# EAGLE design Z80-Clock-And-Reset-1-2 (EAGLE 9.6.2)
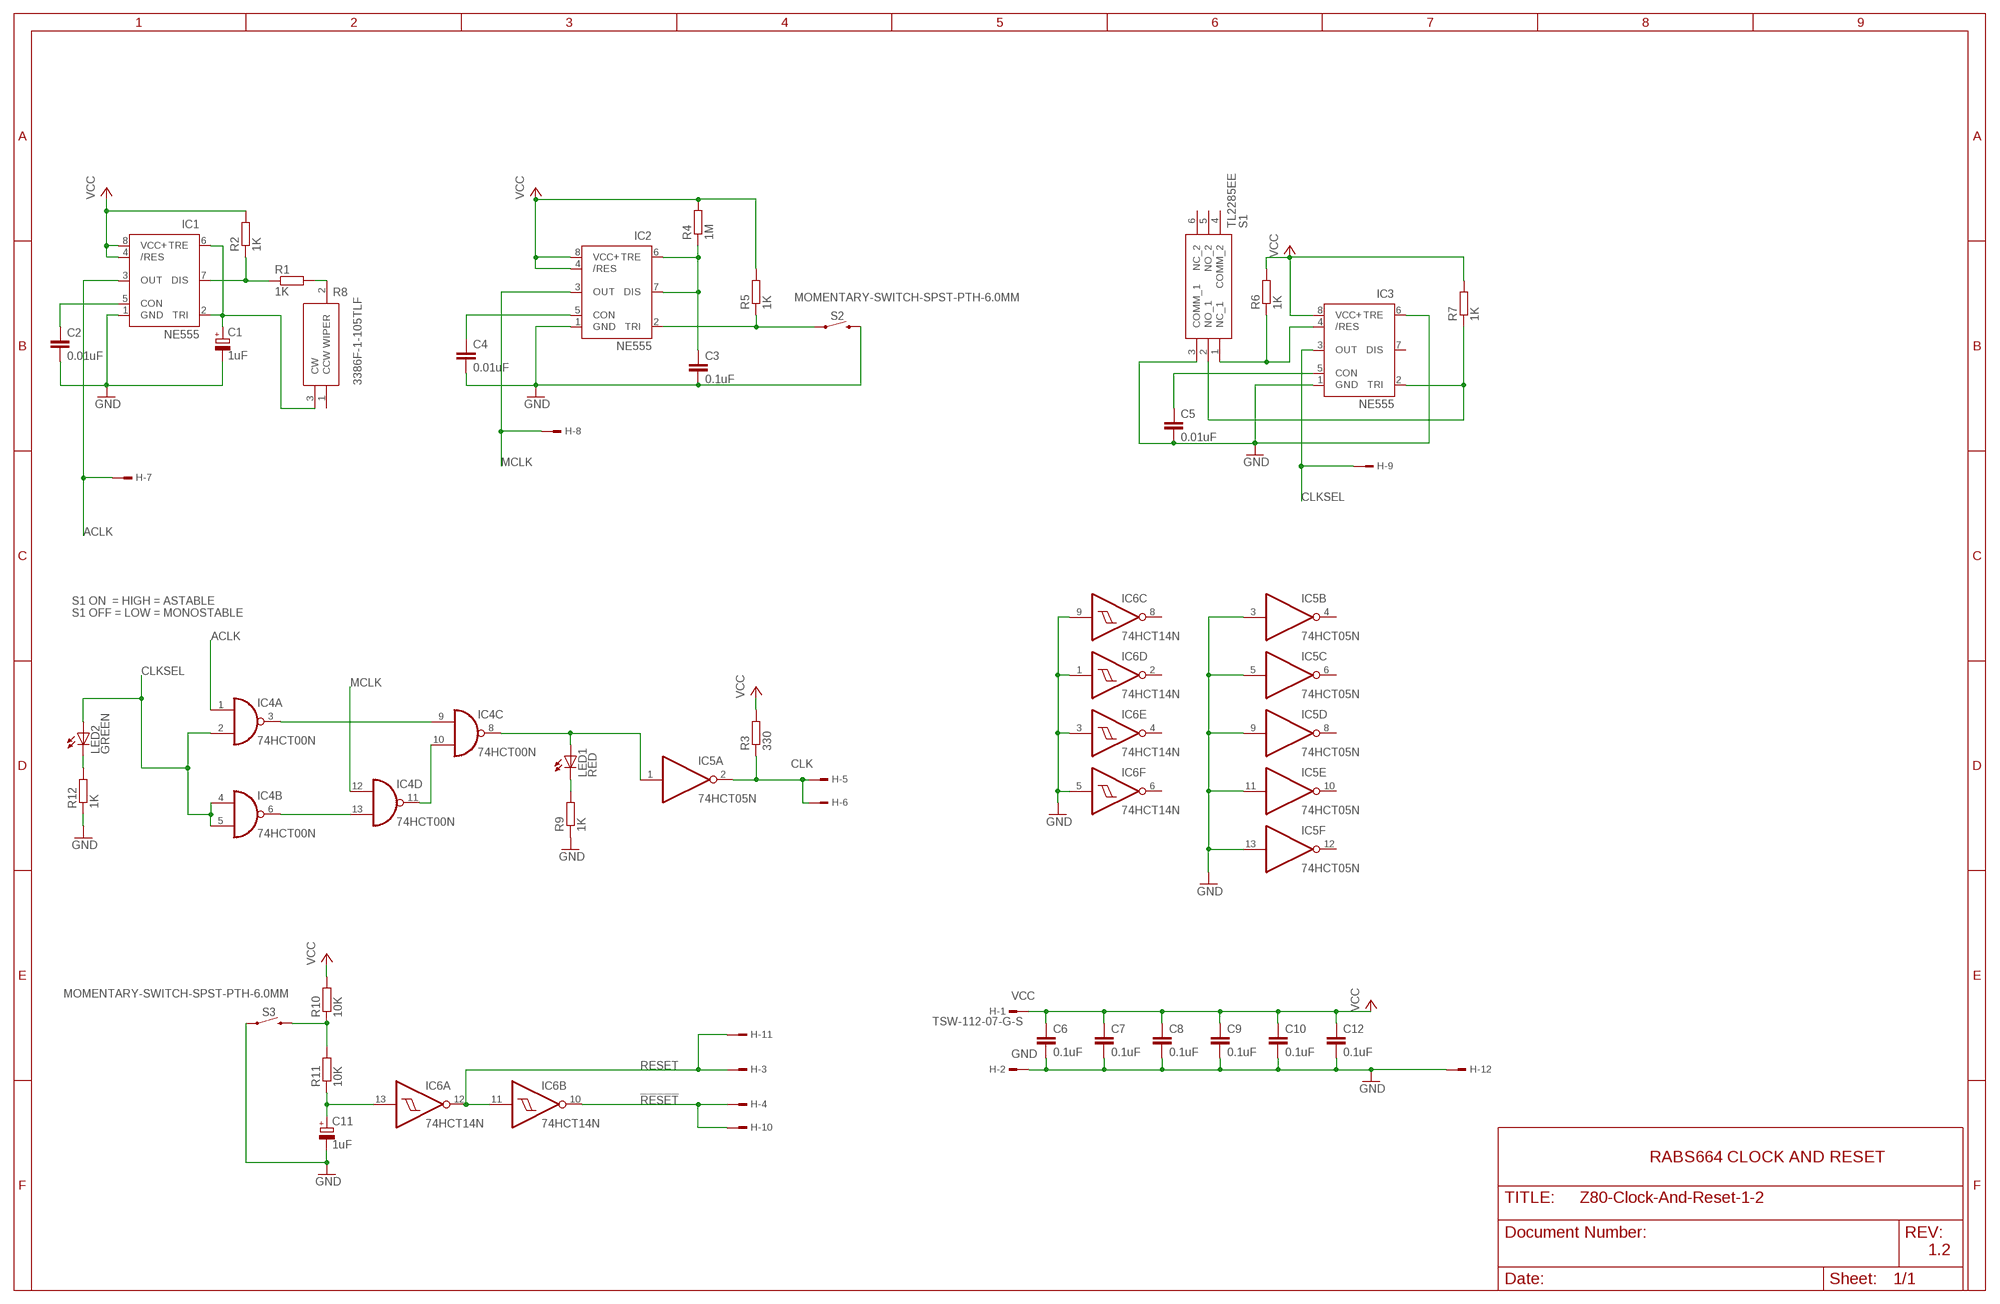
[diagram p0: schematic, sheet 1]

## Parts
C1  1uF  CPOL-EUE2,5-6E  [E2,5-6E]
C2  0.01uF  C-EU050-025X075  [C050-025X075]
C3  0.1uF  C-EU050-025X075  [C050-025X075]
C4  0.01uF  C-EU050-025X075  [C050-025X075]
C5  0.01uF  C-EU050-025X075  [C050-025X075]
C6  0.1uF  C-EU050-025X075  [C050-025X075]
C7  0.1uF  C-EU050-025X075  [C050-025X075]
C8  0.1uF  C-EU050-025X075  [C050-025X075]
C9  0.1uF  C-EU050-025X075  [C050-025X075]
C10  0.1uF  C-EU050-025X075  [C050-025X075]
C11  1uF  CPOL-EUE2,5-6E  [E2,5-6E]
C12  0.1uF  C-EU050-025X075  [C050-025X075]
H  TSW-112-07-G-S  [TSW-112-XX-G-S]
IC1  NE555  [DIL-08]
IC2  NE555  [DIL-08]
IC3  NE555  [DIL-08]
IC4  74HCT00N  [DIL14]
IC5  74HCT05N  [DIL14]
IC6  74HCT14N  [DIL14]
LED1  RED  LED3MM  [LED3MM]
LED2  GREEN  LED3MM  [LED3MM]
R1  1K  R-EU_0207/10  [0207/10]
R2  1K  R-EU_0207/10  [0207/10]
R3  330  R-EU_0207/10  [0207/10]
R4  1M  R-EU_0207/10  [0207/10]
R5  1K  R-EU_0207/10  [0207/10]
R6  1K  R-EU_0207/10  [0207/10]
R7  1K  R-EU_0207/10  [0207/10]
R8  3386F-1-103TLF  [3386F1103TLF]
R9  1K  R-EU_0207/10  [0207/10]
R10  10K  R-EU_0207/10  [0207/10]
R11  10K  R-EU_0207/10  [0207/10]
R12  1K  R-EU_0207/10  [0207/10]
S1  TL2285EE  [TL2285EE]
S2  MOMENTARY-SWITCH-SPST-PTH-6.0MM  [TACTILE_SWITCH_PTH_6.0MM]
S3  MOMENTARY-SWITCH-SPST-PTH-6.0MM  [TACTILE_SWITCH_PTH_6.0MM]

## Nets
!RESET: H.4 H.10 IC6.10(B:O)
ACLK: H.7 IC1.3(OUT) IC4.1(A:I0)
CLK: H.5 H.6 IC5.2(A:O) R3.1
CLKSEL: H.9 IC3.3(OUT) IC4.2(A:I1) IC4.4(B:I0) IC4.5(B:I1) LED2.A
GND [Supply]: C1.- C2.2 C3.2 C4.2 C5.2 C6.2 C7.2 C8.2 C9.2 C10.2 C11.- C12.2 H.2 H.12 IC1.1(GND) IC2.1(GND) IC3.1(GND) IC3.6(TRE) IC5.3(B:I) IC5.5(C:I) IC5.9(D:I) IC5.11(E:I) IC5.13(F:I) IC6.1(D:I) IC6.3(E:I) IC6.5(F:I) IC6.9(C:I) R9.1 R12.1 S1.3(COMM_1) S2.3 S3.1
MCLK: H.8 IC2.3(OUT) IC4.12(D:I0)
N$1: C2.1 IC1.5(CON)
N$2: C1.+ IC1.2(TRI) IC1.6(TRE) R8.3(CW)
N$3: IC1.7(DIS) R1.1 R2.1
N$4: IC3.4(/RES) R6.1 S1.1(NC_1)
N$5: R1.2 R8.2(WIPER)
N$6: C3.1 IC2.6(TRE) IC2.7(DIS) R4.1
N$7: C4.1 IC2.5(CON)
N$8: IC2.2(TRI) R5.1 S2.1
N$9: LED2.K(C) R12.2
N$10: IC4.3(A:O) IC4.9(C:I0)
N$12: C5.1 IC3.5(CON)
N$14: IC4.6(B:O) IC4.13(D:I1)
N$15: IC3.2(TRI) R7.1 S1.2(NO_1)
N$16: IC4.10(C:I1) IC4.11(D:O)
N$17: IC4.8(C:O) IC5.1(A:I) LED1.A
N$18: LED1.K(C) R9.2
N$20: R10.1 R11.2 S3.3
N$21: C11.+ IC6.13(A:I) R11.1
RESET: H.3 H.11 IC6.11(B:I) IC6.12(A:O)
VCC [Supply]: C6.1 C7.1 C8.1 C9.1 C10.1 C12.1 H.1 IC1.4(/RES) IC1.8(VCC+) IC2.4(/RES) IC2.8(VCC+) IC3.8(VCC+) R2.2 R3.2 R4.2 R5.2 R6.2 R7.2 R10.2
Unconnected: IC3.7(DIS) IC5.4(B:O) IC5.6(C:O) IC5.8(D:O) IC5.10(E:O) IC5.12(F:O) IC6.2(D:O) IC6.4(E:O) IC6.6(F:O) IC6.8(C:O) R8.1(CCW) S1.4(COMM_2) S1.5(NO_2) S1.6(NC_2)

## Notes on the sheet
- 3386F-1-105TLF
- S1 ON  = HIGH = ASTABLE
  S1 OFF = LOW = MONOSTABLE
- RABS664 CLOCK AND RESET
- 1.2

## Power pins joined to a net without a drawn wire
GND: IC4.7(P:GND) IC5.7(P:GND) IC6.7(P:GND)
VCC: IC4.14(P:VCC) IC5.14(P:VCC) IC6.14(P:VCC)

## Library data of the parts
C1 C11 = rcl:CPOL-EU: POLARIZED CAPACITOR, European symbol; SPICEPREFIX: C
C2-C10 C12 = rcl:C-EU: CAPACITOR, European symbol; SPICEPREFIX: C
H = con-samtec:TSW-112-*-G-S: THROUGH-HOLE .025" SQ POST HEADER Source: Samtec TSW.pdf; MF: Samtec Inc.; MPN: TSW-112-07-G-S
IC1-IC3 = st-microelectronics:NE555: General purpose bipolar Timer; MF: Arrow Electronics; MPN: NE555N; OC_FARNELL: 1467742; OC_NEWARK: 89K1486
IC4 = 74xx-eu:74*00: Quad 2-input NAND gate
IC5 = 74xx-eu:74*05: Hex INVERTER, open collector
IC6 = 74xx-eu:74*14: Hex schmitt trigger INVERTER
LED1 LED2 = adafruit:LED: LED OSRAM: - CHIPLED LG R971, LG N971, LY N971, LG Q971, LY Q971, LO R971, LY R971 LH N974, LH R974 LS Q976, LO Q976, LY Q976 LO Q996 - Hyper CHIPLED LW Q18S LB Q993, LB Q99A, LB R99A - SideLED LS A670, LO A670, LY A670, LG A670, LP A670 LB A673, LV A673, LT A673, LW A673 LH A674 LY A675 LS A676, LA A676, LO A676, LY A676, LW A676 LS A679, LY A679, LG A679 - Hyper Micro SIDELED® LS Y876, LA Y876, LO Y876, LY Y876 LT Y87S - SmartLED LW L88C, LW L88S LB L89C, LB L89S, LG L890 LS L89K, LO L89K, LY L89K LS L896, LA L896, LO L896, LY L896 - TOPLED LS T670, LO T670, LY T670, LG T670, LP T670 LSG T670, LSP T670, LSY T670, LOP T670, LYG T670 LG T671, LOG T671, LSG T671 LB T673, LV T673, LT T673, LW T673 LH T674 LS T676, LA T676, LO T676, LY T676, LB T676, LH T676, LSB T676, LW T676 LB T67C, LV T67C, LT T67C, LS T67K, LO T67K, LY T67K, LW E67C LS E67B, LA E67B, LO E67B, LY E67B, LB E67C, LV E67C, LT E67C LW T67C LS T679, LY T679, LG T679 LS T770, LO T770, LY T770, LG T770, LP T770 LB T773, LV T773, LT T773, LW T773 LH T774 LS E675, LA E675, LY E675, LS T675 LS T776, LA T776, LO T776, LY T776, LB T776 LHGB T686 LT T68C, LB T68C - Hyper Mini TOPLED® LB M676 - Mini TOPLED Santana® LG M470 LS M47K, LO M47K, LY M47K Source: http://www.osram.convergy.de/
R1-R7 R9-R12 = rcl:R-EU_: RESISTOR, European symbol; SPICEPREFIX: R
R8 = 3386F-1-103TLF:3386F-1-103TLF: Bourns 3386F Series Through Hole Cermet Trimmer Resistor with Pin Terminations, 10k +/-10% 1/2W +/-100ppm/C Finger Adjust Source: Datasheet <https://componentsearchengine.com/Datasheets/1/3386F-1-103TLF.pdf>; ARROW_PART_NUMBER: 3386F-1-103TLF; ARROW_PRICE-STOCK: https://www.arrow.com/en/products/3386f-1-103tlf/bourns?region=europe; DESCRIPTION: Bourns 3386F Series Through Hole Cermet Trimmer Resistor with Pin Terminations, 10k +/-10% 1/2W +/-100ppm/C Finger Adjust; HEIGHT: 4.83mm; MANUFACTURER_NAME: Bourns; MANUFACTURER_PART_NUMBER: 3386F-1-103TLF; MOUSER_PART_NUMBER: 652-3386F-1-103TLF; MOUSER_PRICE-STOCK: https://www.mouser.co.uk/ProductDetail/Bourns/3386F-1-103TLF?qs=nE0RJHjSZ6XfMI2vt3zUow%3D%3D
S1 = TL2285EE:TL2285EE: Tactile Switches DPDT ALT ACT PC MNT Source: Datasheet <https://componentsearchengine.com/Datasheets/1/TL2285EE.pdf>; DESCRIPTION: Tactile Switches DPDT ALT ACT PC MNT; HEIGHT: 13mm; MANUFACTURER_NAME: E-Switch; MANUFACTURER_PART_NUMBER: TL2285EE; MOUSER_PART_NUMBER: 612-TL2285EE; MOUSER_PRICE-STOCK: https://www.mouser.co.uk/ProductDetail/E-Switch/TL2285EE?qs=7Bi7Dg8SEnxrzf04kzdLHA%3D%3D
S2 S3 = SparkFun-Switches:MOMENTARY-SWITCH-SPST: Momentary Switch (Pushbutton) - SPST Normally-open (NO) SPST momentary switches (buttons, pushbuttons). Variants PTH-12MM - 12mm square, through-hole Momentary Pushbutton Switch - 12mm Square <https://www.sparkfun.com/products/9190> (COM-09190) PTH-6.0MM, PTH-6.0MM-KIT - 6.0mm square, through-hole Mini Pushbutton Switch <https://www.sparkfun.com/products/97> (COM-00097) KIT package intended for soldering kit's - only one side of pads' copper is exposed. PTH-RIGHT-ANGLE-KIT - Right-angle, through-hole Right Angle Tactile Button <https://www.sparkfun.com/products/10791> - Used on SparkFun BigTime Watch Kit <https://www.sparkfun.com/products/11734> SMD-12MM - 12mm square, surface-mount Tactile Button - SMD (12mm) <https://www.sparkfun.com/products/12993> (COM-12993) Used on SparkFun PicoBoard <https://www.sparkfun.com/products/11888> SMD-4.5MM - 4.5mm Square Trackball Switch Used on SparkFun Blackberry Trackballer Breakout <https://www.sparkfun.com/products/13169> SMD-4.6MMX2.8MM - 4.60mm x 2.80mm, surface mount Used on SparkFun Pro Micro - RP2040 <https://www.sparkfun.com/products/17717> SMD-5.2MM, SMD-5.2-REDUNDANT - 5.2mm square, surface-mount Mini Pushbutton Switch - SMD <https://www.sparkfun.com/products/8720> (COM-08720) Used on Arduino Pro Mini <https://www.sparkfun.com/products/11114> REDUNDANT package connects both switch circuits together SMD-6.0X3.5MM - 6.0 x 3.5mm, surface mount Momentary Reset Switch SMD <https://www.sparkfun.com/products/8229> (COM-08229) SMD-6.2MM-TALL - 6.2mm square, surface mount Tactile Button - SMD (6mm) <https://www.sparkfun.com/products/12992> Used on SparkFun Digital Sandbox <https://www.sparkfun.com/products/12651> SMD-RIGHT-ANGLE - Right-angle, surface mount Used on SparkFun Block for Intel® Edison - Arduino <https://www.sparkfun.com/products/13036>; PROD_ID: SWCH-08441; SF_SKU: COM-00097

## Net classes
0 default: width 0.254 mm, clearance 0.254 mm
1 Supply: width 0.508 mm, clearance 0.508 mm

## Board
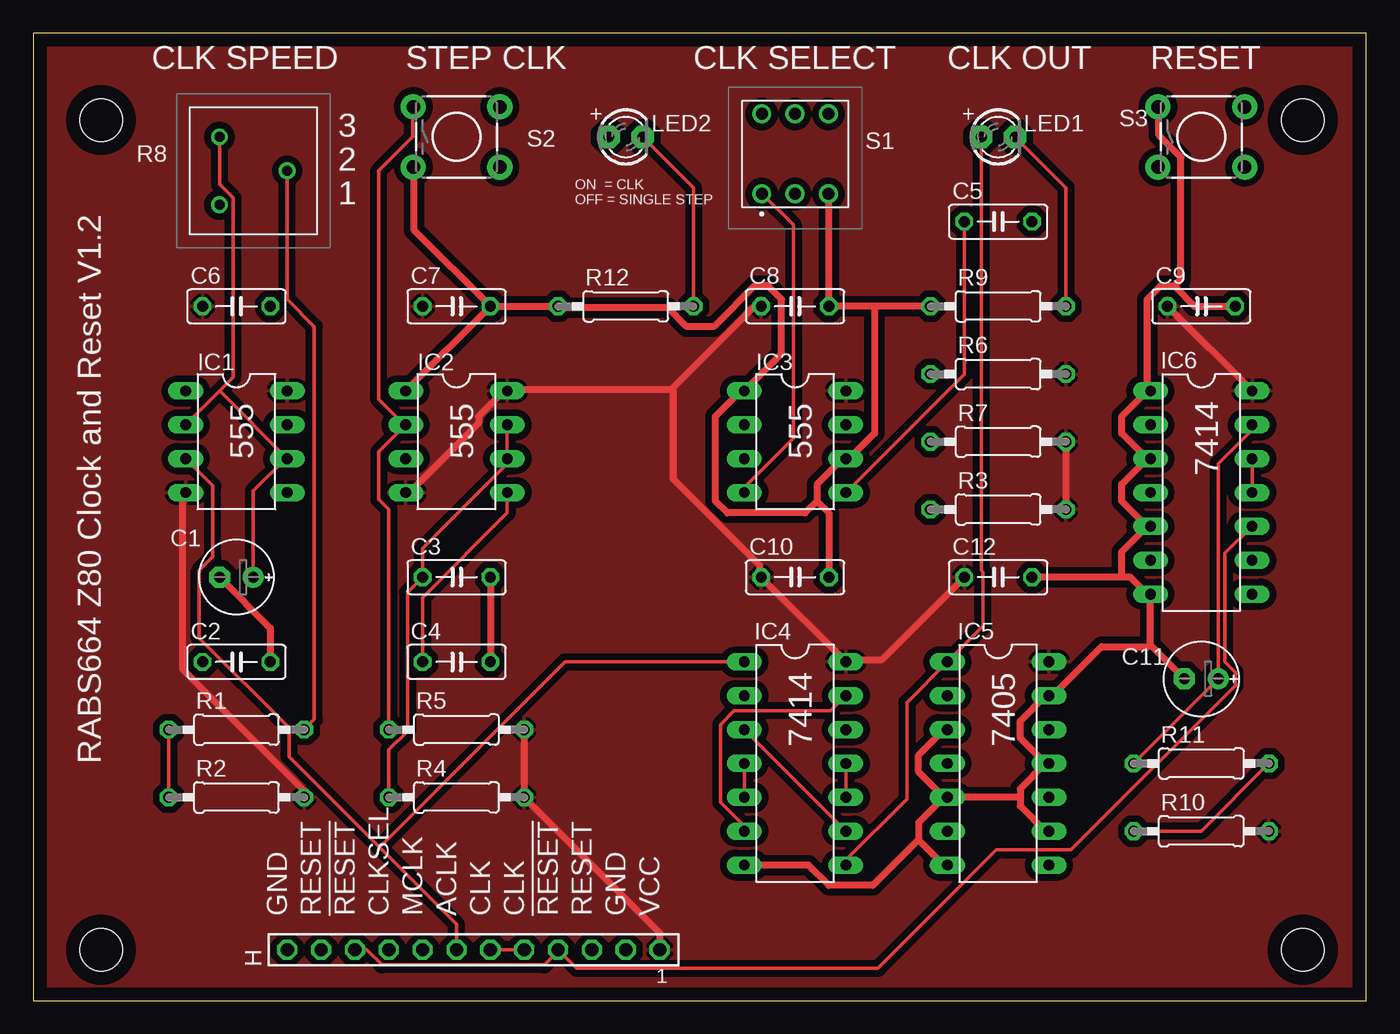
[diagram p1: board, top side]
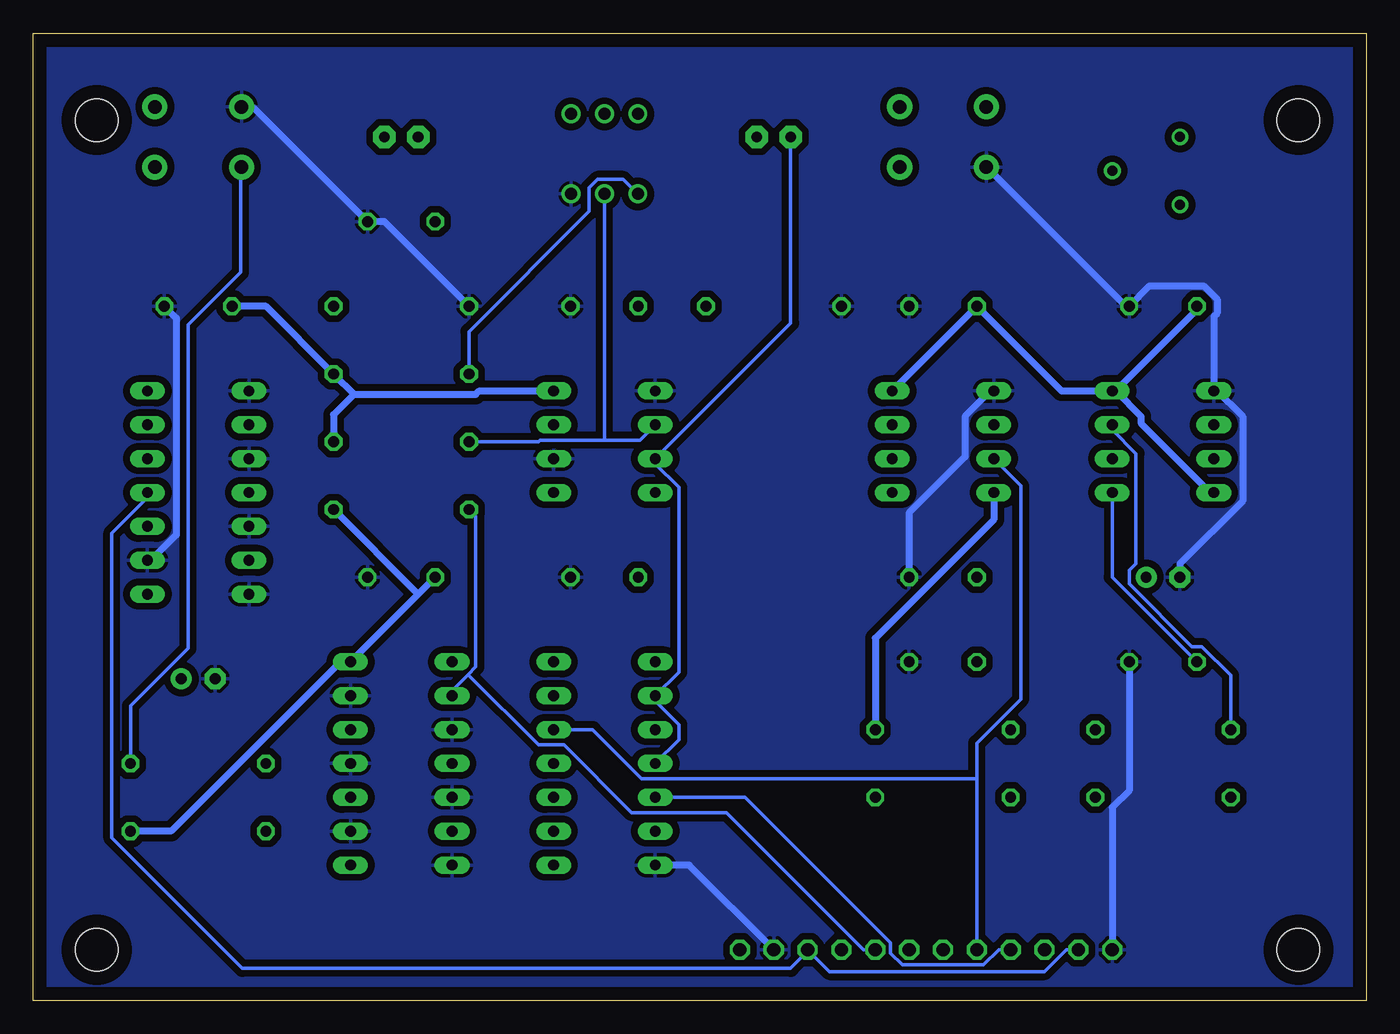
[diagram p2: board, bottom side, seen from below]

Size 100 x 72.54 mm. Coordinates in mm from the lower left corner, seen from the top.
Outline: 0,0 100,0 100,72.54 0,72.54 0,0
Copper layers (1*16): Top 0.035mm / dielectric 1.5mm / Bottom 0.035mm
Design rules "default": minimum track width 6mil, minimum drill 0.35mm, track to track 6mil, track to pad 6mil, pad to pad 6mil, via to via 6mil, smd to smd 6mil, copper to edge 40mil, drill to drill 6mil, minimum pad ring 10mil, minimum via ring 8mil, stop-mask expansion 4mil, vias tented up to drill 0mil, thermal gap 10mil
Holes 3.2 mm at 5.08,66.04 5.08,3.81 95.25,3.81 95.25,66.04

### Footprints (pad centres in the part's own frame; a part is rotated, then mirrored left to right if it is on the bottom)
E2,5-6E = drill 0.813 pad 1.575: + -1.27,0 | drill 0.813 pad 1.575 octagon: - 1.27,0
C050-025X075 = drill 0.813 octagon: 1 -2.54,0; 2 2.54,0
TSW-112-XX-G-S = drill 1 pad 1.5 octagon: 1 13.97,0; 2 11.43,0; 3 8.89,0; 4 6.35,0; 5 3.81,0; 6 1.27,0; 7 -1.27,0; 8 -3.81,0; 9 -6.35,0; 10 -8.89,0; 11 -11.43,0; 12 -13.97,0
DIL-08 = drill 0.813 long: 1 -3.81,-3.81; 2 -1.27,-3.81; 3 1.27,-3.81; 4 3.81,-3.81; 5 3.81,3.81; 6 1.27,3.81; 7 -1.27,3.81; 8 -3.81,3.81
DIL14 = drill 0.813 long: 1 -7.62,-3.81; 2 -5.08,-3.81; 3 -2.54,-3.81; 4 0,-3.81; 5 2.54,-3.81; 6 5.08,-3.81; 7 7.62,-3.81; 8 7.62,3.81; 9 5.08,3.81; 10 2.54,3.81; 11 0,3.81; 12 -2.54,3.81; 13 -5.08,3.81; 14 -7.62,3.81
LED3MM = drill 0.813 pad 1.676 octagon: A -1.27,0; K 1.27,0
0207/10 = drill 0.813 octagon: 1 -5.08,0; 2 5.08,0
3386F1103TLF = drill 0.75 pad 1.2: 1 0,0; 2 2.54,-5.08; 3 5.08,0
TL2285EE = drill 0.9 pad 1.4: 1 -2.5,-3; 2 0,-3; 3 2.5,-3; 4 -2.5,3; 5 0,3; 6 2.5,3
TACTILE_SWITCH_PTH_6.0MM = drill 1.016 pad 1.88: 1 -3.251,2.261; 2 3.251,2.261; 3 -3.251,-2.261; 4 3.251,-2.261

### Placement (x,y rotation side)
C1  15.24,31.75 180 top
C2  15.24,25.4 0 top
C3  31.75,31.75 0 top
C4  31.75,25.4 0 top
C5  72.39,58.42 0 top
C6  15.24,52.07 0 top
C7  31.75,52.07 0 top
C8  57.15,52.07 0 top
C9  87.63,52.07 0 top
C10  57.15,31.75 0 top
C11  87.63,24.13 180 top
C12  72.39,31.75 0 top
H  33.02,3.81 0 top
IC1  15.24,41.91 270 top
IC2  31.75,41.91 270 top
IC3  57.15,41.91 270 top
IC4  57.15,17.78 270 top
IC5  72.39,17.78 270 top
IC6  87.63,38.1 270 top
LED1  72.39,64.77 0 top
LED2  44.45,64.77 0 top
R1  15.24,20.32 0 top
R2  15.24,15.24 0 top
R3  72.39,36.83 0 top
R4  31.75,15.24 0 top
R5  31.75,20.32 0 top
R6  72.39,46.99 0 top
R7  72.39,41.91 0 top
R8  13.97,59.69 90 top
R9  72.39,52.07 0 top
R10  87.63,12.7 0 top
R11  87.63,17.78 0 top
R12  44.45,52.07 0 top
S1  57.15,63.5 0 top
S2  31.75,64.77 0 top
S3  87.63,64.77 0 top

### Tracks (layer width: path | path; a pad name or v marks a point on that pad's centre or on a via)
!RESET
  Top 0.254: IC6.10 89.41,33.53 89.41,25.4 90.17,24.64 90.17,23.62 77.85,11.3 72.26,11.3 63.37,2.41 40.77,2.41 H.4 39.37,3.68 38.35,2.67 26.16,2.67 25.02,3.81 H.10
ACLK
  Top 0.254: IC1.3 13.46,38.61 13.46,33.27 12.45,32.26 12.45,27.18 19.18,20.45 19.18,18.29 25.97,11.49 | 25.97,11.49 31.75,5.71 H.7 | IC4.1 39.88,25.4 25.97,11.49
CLK
  Top 0.254: H.5 H.6
  Bottom 0.254: IC5.2 68.58,23.24 67.37,24.45 | 67.37,24.45 66.8,25.02 66.8,36.32 R3.1 | H.5 37.72,3.81 48.01,14.1 55.12,14.1 60.2,19.18 62.1,19.18 67.37,24.45
CLKSEL
  Top 0.254: IC4.4 IC4.5
  Bottom 0.254: IC4.4 51.56,19.56 51.56,20.7 53.34,22.48 IC4.2 51.56,24.64 51.56,38.48 53.34,40.26 IC3.3 43.18,50.8 LED2.A | H.9 27.56,3.81 28.7,2.67 34.8,2.67 35.69,3.56 35.69,4.32 46.61,15.24 IC4.5
GND
  Top 0.508: C2.2 17.78,27.94 C1.- | C3.2 C4.2 | C7.2 IC2.1 | C7.2 R12.1 39.5,51.94 47.62,51.94 49.02,50.55 51.05,50.55 54.1,53.59 55.12,53.59 56.13,52.58 56.13,48.51 IC3.1 53.09,45.72 51.18,43.81 51.18,37.47 52.07,36.58 57.91,36.58 58.8,37.47 | C7.2 28.57,57.78 28.57,62.48 S2.3 | C10.2 59.69,36.58 58.8,37.47 | 58.8,37.47 58.8,38.73 60.71,40.64 IC3.6 61.09,40.77 61.34,40.77 63.12,42.55 63.12,52.07 | R9.1 63.12,52.07 | 63.12,52.07 C8.2 59.69,60.45 S1.3 | 83.82,26.67 IC6.7 83.69,30.35 82.3,31.75 81.66,31.75 | C11.- 83.82,26.67 | 81.66,31.75 C12.2 | 81.66,31.75 81.66,33.66 83.57,35.56 IC6.5 83.44,35.69 81.66,37.47 81.66,38.73 83.57,40.64 IC6.3 83.44,40.77 81.66,42.55 81.66,43.81 83.57,45.72 IC6.1 83.57,45.85 83.57,52.58 84.58,53.59 85.6,53.59 | C9.2 87.12,52.07 85.6,53.59 | IC5.7 68.33,10.16 66.42,12.06 | 66.42,12.06 66.42,13.34 68.33,15.24 IC5.5 | IC5.3 68.33,20.32 66.42,18.41 66.42,17.14 68.2,15.37 IC5.5 | IC5.9 75.95,12.7 74.04,14.61 74.04,15.24 | 74.04,15.24 74.04,15.88 75.95,17.78 IC5.11 75.82,17.91 74.04,19.68 74.04,20.95 75.95,22.86 IC5.13 76.33,22.73 80.14,26.54 83.69,26.54 83.82,26.67 | 74.04,15.24 IC5.5 | IC4.7 58.17,10.16 59.69,8.64 62.99,8.64 66.42,12.06 | 85.6,53.59 86.11,54.1 86.11,63.25 84.45,64.9 84.45,66.93 S3.1
  Bottom 0.508: H.12 19.05,14.48 17.78,15.75 C2.2 | C3.2 34.29,36.58 30.1,40.77 30.1,43.81 28.19,45.72 IC2.1 | S2.3 28.45,62.48 18.16,52.2 17.91,52.2 C6.2 16.26,53.59 12.19,53.59 11.18,52.58 11.18,51.56 11.43,51.31 IC1.1 11.3,45.85 9.27,43.81 9.27,37.47 13.97,32.77 C1.- | R9.1 73.66,58.42 C5.2 83.44,66.93 84.33,66.93 S3.1 | IC6.9 91.19,33.02 89.28,34.92 89.28,51.18 C9.2 | IC4.7 50.8,10.16 H.2
  pour Bottom: -1.27,73.66 -1.27,-1.27 101.6,-1.27 101.6,73.66
MCLK
  Bottom 0.254: IC2.3 25.91,38.61 25.91,22.61 29.21,19.3 29.21,16.64 | H.8 29.21,16.64 | IC4.12 58.04,20.32 54.36,16.64 29.21,16.64
N$1
  Bottom 0.254: C2.1 19.05,31.75 IC1.5
N$2
  Top 0.254: R8.3 13.97,61.21 14.99,60.2 14.99,46.74 13.97,45.72 | IC1.2 13.97,45.72 | 13.97,45.72 IC1.6 18.92,40.64 16.51,38.23 C1.+
N$3
  Top 0.254: R1.1 R2.1
  Bottom 0.254: IC1.7 19.05,42.8 17.27,41.02 17.27,32.77 17.78,32.26 17.78,31.24 13.08,26.54 12.32,26.54 10.16,24.38 R1.1
N$4
  Top 0.254: IC3.4 53.34,38.48 57.02,42.16 57.02,58.17 54.74,60.45 S1.1
  Bottom 0.254: R6.1 67.31,50.16 58.29,59.18 58.29,60.96 57.66,61.59 55.75,61.59 54.74,60.58 S1.1
N$5
  Top 0.254: R8.2 19.05,52.58 21.08,50.55 21.08,21.08 R1.2
N$6
  Top 0.254: IC2.7 IC2.6 35.56,40.26 29.21,33.91 C3.1 28.07,30.61 28.07,20.19 26.67,18.8 R4.1
N$7
  Top 0.254: C4.1 29.21,30.23 35.56,36.58 IC2.5
N$8
  Top 0.254: R5.1 26.67,36.83 25.91,37.59 25.91,41.15 IC2.2 27.81,43.18 25.91,45.09 25.91,62.23 28.45,64.77 28.45,66.93 S2.1
N$9
  Top 0.254: R12.2 49.53,60.96 LED2.K
N$10
  Top 0.254: IC4.9 IC4.3
N$12
  Top 0.254: IC3.5 69.85,46.99 C5.1
N$14
  Top 0.254: IC4.6 53.34,13.08 51.56,14.86 51.56,20.7 52.58,21.72 59.82,21.72 IC4.13
N$15
  Bottom 0.254: R7.1 62.1,41.91 61.98,42.04 57.15,42.04 | 57.15,42.04 54.48,42.04 IC3.2 | 57.15,42.04 S1.2
N$16
  Top 0.254: IC4.11 IC4.10
N$17
  Top 0.254: IC4.8 60.96,10.54 65.53,15.11 65.53,22.35 IC5.1 71.25,28.07 71.25,32.13 71.12,32.26 LED1.A
N$18
  Top 0.254: R9.2 77.47,60.96 LED1.K
N$20
  Top 0.254: R10.1 87.63,12.7 R11.2
  Bottom 0.254: R11.2 92.71,22.1 88.39,26.42 88.39,50.67 84.45,54.61 84.45,62.48 S3.3
N$21
  Top 0.254: R11.1 C11.+ 88.9,40.26 91.44,42.8 IC6.13
RESET
  Top 0.254: IC6.12 IC6.11
  Bottom 0.254: H.11 22.48,3.81 24.13,2.16 40.26,2.16 H.3 41.91,3.68 43.18,2.41 84.33,2.41 94.11,12.19 94.11,35.05 91.44,37.72 IC6.11
VCC
  Top 0.508: C9.1 IC6.14 | R7.2 R3.2 | C12.1 63.63,25.53 61.09,25.53 IC4.14 C10.1 54.48,31.88 54.48,32.64 48.01,39.12 48.01,45.72 47.88,45.85 | R2.2 20.32,15.75 11.18,24.89 11.18,37.85 IC1.4 | R5.2 R4.2 46.99,5.08 H.1 | IC2.4 28.19,38.1 33.4,43.31 33.4,43.81 35.31,45.72 IC2.8 35.69,45.85 47.88,45.85 | C8.1 54.1,52.07 47.88,45.85
  Bottom 0.508: IC3.8 66.55,45.72 66.8,45.47 75.95,45.47 | 75.95,45.47 R6.2 82.55,52.07 C9.1 | R7.2 77.47,43.94 75.95,45.47 | C12.1 71.12,30.48 | 71.12,30.48 IC5.14 76.33,25.27 77.09,25.27 89.66,12.7 R10.2 | 71.12,30.48 R3.2 | IC1.4 11.68,38.1 16.89,43.31 16.89,43.81 18.8,45.72 IC1.8 | C6.1 12.7,51.82 18.67,45.85 IC1.8 | IC2.8 C7.1 22.86,45.72 IC1.8 | R5.2 36.83,27.18 27.94,36.07 IC2.4
  pour Top: -1.27,73.66 -1.27,-1.27 100.33,-1.27 101.6,-1.27 101.6,73.66

### Text on the board
tNames: CLK SPEED | STEP CLK | CLK SELECT | CLK OUT | RESET | 3 | 2 | 1 | ON = CLK / OFF = SINGLE STEP | 555 | 555 | 555 | 7414 | 7414 | 7405 | RABS664 Z80 Clock and Reset V1.2 | GND | RESET | !RESET | CLKSEL | MCLK | ACLK | CLK | CLK | !RESET | RESET | GND | VCC